# Altium schematic sheet uMultimeter_ExpGPIO_Sch.SchDoc: MicroMultimeter_ExpGPIO
size 127 x 101 mm; Author: Hom; CompanyName: KitSprout; DrawnBy: Hom; Engineer: Hom; Organization: KitSprout; Revision: A; SheetNumber: 1; SheetTotal: 1; License: CC BY-SA 4.0; Version: 2.0; LibVersion: 2.0; PageSetup: Record=PageOptions|CenterHorizontal=True|CenterVertical=True|PrintScale=1.00|XCorrection=1.00|YCorrection=1.00|PrintKind=0|BorderSize=5000000|LeftOffset=0|BottomOffset=0|Orientation=2|PaperLength=1000|PaperWidth=1000|Scale=100|PaperSource=7|PrintQuality=-3|MediaType=1|DitherType=10|PrintScaleMode=0|PaperKind=A4|PaperIndex=9
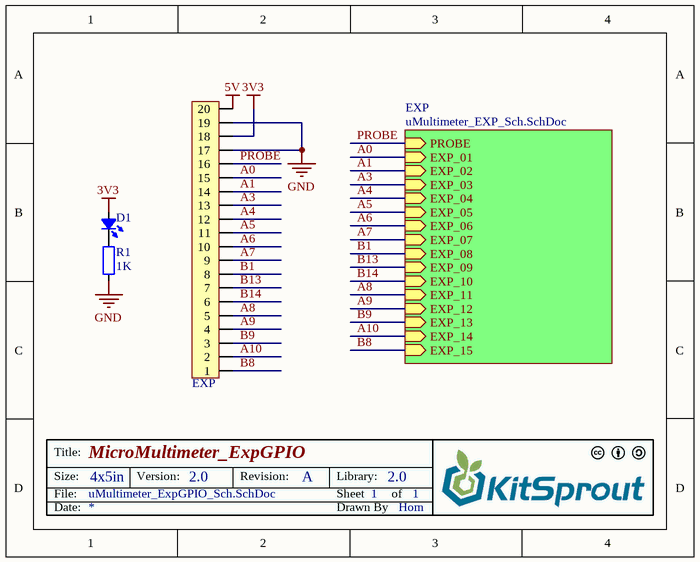
[diagram p0: uMultimeter_ExpGPIO_Sch.SchDoc]

## Parts
D1  LED_0805  [LED_0805_BLUE]  (value not drawn)
EXP  HDR1x20_2.54  [HDR1X20_2.54_180H]  (value not drawn)
R1  value 1K  [RES_0603]  (hidden comment: Res_0603)

## Sub-sheets
EXP = uMultimeter_EXP_Sch.SchDoc: PROBE (in), EXP_01 (in), EXP_02 (in), EXP_03 (in), EXP_04 (in), EXP_05 (in), EXP_06 (in), EXP_07 (in), EXP_08 (in), EXP_09 (in), EXP_10 (in), EXP_11 (in), EXP_12 (in), EXP_13 (in), EXP_14 (in), EXP_15 (in)

## Nets
3V3: D1.1(A) EXP.18
5V: EXP.20
GND: EXP.17 EXP.19 R1.2
A0: EXP.15 ; sheet EXP/EXP_01
A1: EXP.14 ; sheet EXP/EXP_02
A3: EXP.13 ; sheet EXP/EXP_03
A4: EXP.12 ; sheet EXP/EXP_04
A5: EXP.11 ; sheet EXP/EXP_05
A6: EXP.10 ; sheet EXP/EXP_06
A7: EXP.9 ; sheet EXP/EXP_07
A8: EXP.5 ; sheet EXP/EXP_11
A9: EXP.4 ; sheet EXP/EXP_12
A10: EXP.2 ; sheet EXP/EXP_14
B1: EXP.8 ; sheet EXP/EXP_08
B8: EXP.1 ; sheet EXP/EXP_15
B9: EXP.3 ; sheet EXP/EXP_13
B13: EXP.7 ; sheet EXP/EXP_09
B14: EXP.6 ; sheet EXP/EXP_10
PROBE: EXP.16 ; sheet EXP/PROBE
NetD1_2: D1.2(K) R1.1

## Notes on the sheet
- Title:
- Size:
- Date:
- File:
- 4x5in
- Version:
- Revision:
- Sheet
- Drawn By
- Library:
- of

## Library data of the parts
D1 = LED_0805: LED
EXP = HDR1x20_2.54: Header
R1 = Res_0603: Resistor